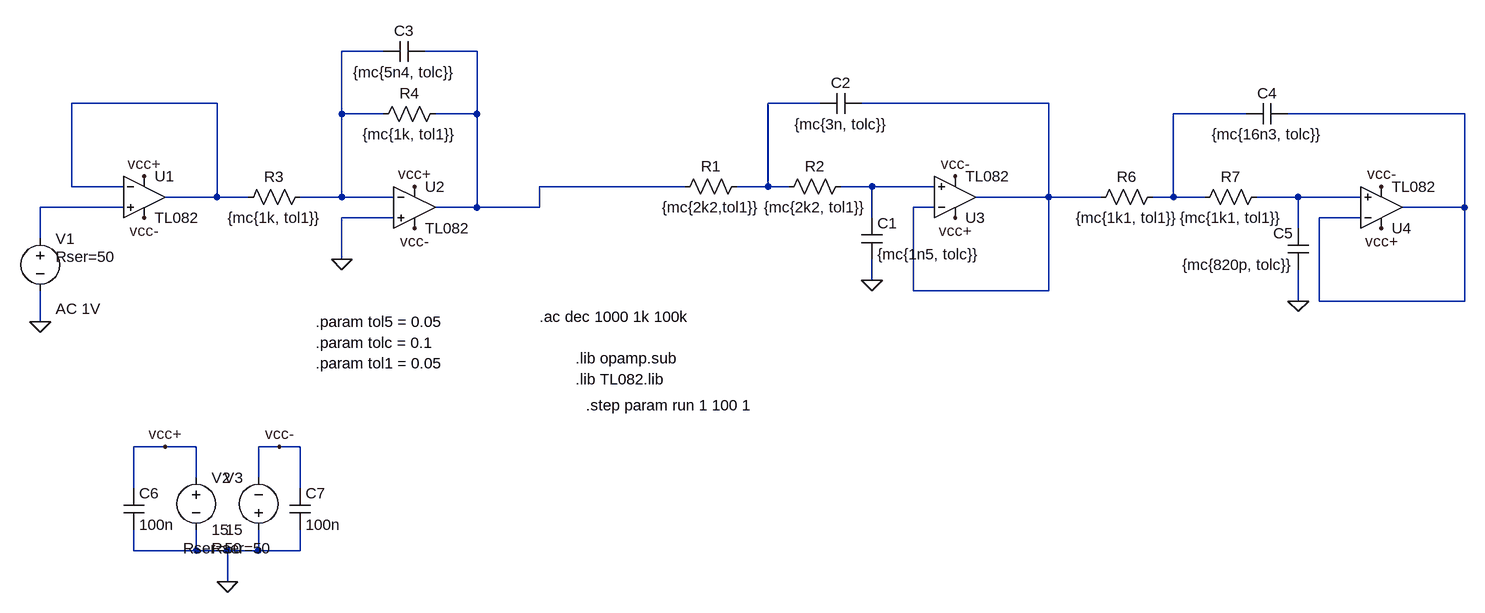
[diagram p0: schematic tc_tp5_ej1_leg.asc]
tc_tp5_ej1_leg.asc, the LTspice schematic file:
Version 4
SHEET 1 1312 724
WIRE -384 -112 -448 -112
WIRE -240 -112 -320 -112
WIRE -640 -32 -864 -32
WIRE 288 -32 208 -32
WIRE 640 -32 352 -32
WIRE -448 -16 -448 -112
WIRE -384 -16 -448 -16
WIRE -240 -16 -240 -112
WIRE -240 -16 -304 -16
WIRE 944 -16 832 -16
WIRE 1280 -16 1008 -16
WIRE -864 96 -864 -32
WIRE -784 96 -864 96
WIRE 80 96 -144 96
WIRE 208 96 208 -32
WIRE 208 96 160 96
WIRE 240 96 208 96
WIRE 368 96 320 96
WIRE 464 96 368 96
WIRE -640 112 -640 -32
WIRE -640 112 -720 112
WIRE -592 112 -640 112
WIRE -448 112 -448 -16
WIRE -448 112 -512 112
WIRE -368 112 -448 112
WIRE 640 112 640 -32
WIRE 640 112 528 112
WIRE 720 112 640 112
WIRE 832 112 832 -16
WIRE 832 112 800 112
WIRE 880 112 832 112
WIRE 1024 112 960 112
WIRE 1120 112 1024 112
WIRE -784 128 -912 128
WIRE -240 128 -240 -16
WIRE -240 128 -304 128
WIRE -144 128 -144 96
WIRE -144 128 -240 128
WIRE 464 128 432 128
WIRE 1280 128 1280 -16
WIRE 1280 128 1184 128
WIRE -368 144 -448 144
WIRE 368 144 368 96
WIRE 1120 144 1056 144
WIRE 1024 160 1024 112
WIRE -912 176 -912 128
WIRE -448 208 -448 144
WIRE 368 240 368 208
WIRE 432 256 432 128
WIRE 640 256 640 112
WIRE 640 256 432 256
WIRE 1024 272 1024 224
WIRE 1056 272 1056 144
WIRE 1280 272 1280 128
WIRE 1280 272 1056 272
WIRE -912 304 -912 256
WIRE -720 496 -768 496
WIRE -672 496 -720 496
WIRE -544 496 -576 496
WIRE -512 496 -544 496
WIRE -672 544 -672 496
WIRE -576 544 -576 496
WIRE -768 560 -768 496
WIRE -512 560 -512 496
WIRE -768 656 -768 624
WIRE -672 656 -672 624
WIRE -672 656 -768 656
WIRE -624 656 -672 656
WIRE -576 656 -576 624
WIRE -576 656 -624 656
WIRE -512 656 -512 624
WIRE -512 656 -576 656
WIRE -624 704 -624 656
FLAG -912 304 0
FLAG 368 240 0
FLAG -448 208 0
FLAG 1024 272 0
FLAG -624 704 0
FLAG -720 496 vcc+
FLAG -752 80 vcc+
FLAG -336 96 vcc+
FLAG 496 144 vcc+
FLAG -544 496 vcc-
FLAG 496 80 vcc-
FLAG -336 160 vcc-
FLAG -752 144 vcc-
FLAG 1152 160 vcc+
FLAG 1152 96 vcc-
SYMBOL res 176 80 R90
WINDOW 0 0 56 VBottom 2
WINDOW 3 32 56 VTop 2
SYMATTR InstName R1
SYMATTR Value {mc{2k2,tol1}}
SYMBOL res 336 80 R90
WINDOW 0 0 56 VBottom 2
WINDOW 3 32 56 VTop 2
SYMATTR InstName R2
SYMATTR Value {mc{2k2, tol1}}
SYMBOL cap 352 144 R0
SYMATTR InstName C1
SYMATTR Value {mc{1n5, tolc}}
SYMBOL cap 352 -48 R90
WINDOW 0 0 32 VBottom 2
WINDOW 3 32 32 VTop 2
SYMATTR InstName C2
SYMATTR Value {mc{3n, tolc}}
SYMBOL voltage -912 160 R0
WINDOW 123 24 124 Left 2
WINDOW 39 24 44 Left 2
SYMATTR Value2 AC 1V
SYMATTR SpiceLine Rser=50
SYMATTR InstName V1
SYMATTR Value ""
SYMBOL res -496 96 R90
WINDOW 0 0 56 VBottom 2
WINDOW 3 32 56 VTop 2
SYMATTR InstName R3
SYMATTR Value {mc{1k, tol1}}
SYMBOL res -288 -32 R90
WINDOW 0 0 56 VBottom 2
WINDOW 3 32 56 VTop 2
SYMATTR InstName R4
SYMATTR Value {mc{1k, tol1}}
SYMBOL cap -320 -128 R90
WINDOW 0 0 32 VBottom 2
WINDOW 3 32 32 VTop 2
SYMATTR InstName C3
SYMATTR Value {mc{5n4, tolc}}
SYMBOL res 816 96 R90
WINDOW 0 0 56 VBottom 2
WINDOW 3 32 56 VTop 2
SYMATTR InstName R6
SYMATTR Value {mc{1k1, tol1}}
SYMBOL res 976 96 R90
WINDOW 0 0 56 VBottom 2
WINDOW 3 32 56 VTop 2
SYMATTR InstName R7
SYMATTR Value {mc{1k1, tol1}}
SYMBOL cap 1008 -32 R90
WINDOW 0 0 32 VBottom 2
WINDOW 3 32 32 VTop 2
SYMATTR InstName C4
SYMATTR Value {mc{16n3, tolc}}
SYMBOL cap 1040 224 R180
WINDOW 0 24 56 Left 2
WINDOW 3 24 8 Left 2
SYMATTR InstName C5
SYMATTR Value {mc{820p, tolc}}
SYMBOL Opamps\\opamp2 -752 48 R0
SYMATTR InstName U1
SYMATTR Value TL082
SYMBOL Opamps\\opamp2 -336 64 R0
SYMATTR InstName U2
SYMATTR Value TL082
SYMBOL Opamps\\opamp2 496 176 M180
SYMATTR InstName U3
SYMATTR Value TL082
SYMBOL Opamps\\opamp2 1152 192 M180
SYMATTR InstName U4
SYMATTR Value TL082
SYMBOL cap -784 560 R0
SYMATTR InstName C6
SYMATTR Value 100n
SYMBOL cap -528 560 R0
SYMATTR InstName C7
SYMATTR Value 100n
SYMBOL voltage -672 528 R0
WINDOW 123 0 0 Left 0
WINDOW 39 24 124 Left 2
SYMATTR SpiceLine Rser=50
SYMATTR InstName V2
SYMATTR Value 15
SYMBOL voltage -576 640 R180
WINDOW 0 24 96 Left 2
WINDOW 3 24 16 Left 2
WINDOW 123 0 0 Left 0
WINDOW 39 24 -12 Left 2
SYMATTR InstName V3
SYMATTR Value 15
SYMATTR SpiceLine Rser=50
TEXT -144 296 Left 2 !.ac dec 1000 1k 100k
TEXT -88 360 Left 2 !.lib opamp.sub
TEXT -488 304 Left 2 !.param tol5 = 0.05
TEXT -488 336 Left 2 !.param tolc = 0.1
TEXT -488 368 Left 2 !.param tol1 = 0.05
TEXT -88 392 Left 2 !.lib TL082.lib
TEXT -72 432 Left 2 !.step param run 1 100 1

The netlist it stands for:
* tc_tp5_ej1_leg.asc
R1 N004 N002 {mc{2k2,tol1}}
R2 N008 N004 {mc{2k2, tol1}}
C1 N008 0 {mc{1n5, tolc}}
C2 N005 N004 {mc{3n, tolc}}
V1 N010 0 AC 1V Rser=50
R3 N001 N003 {mc{1k, tol1}}
R4 N002 N001 {mc{1k, tol1}}
C3 N002 N001 {mc{5n4, tolc}}
R6 N006 N005 {mc{1k1, tol1}}
R7 N009 N006 {mc{1k1, tol1}}
C4 N007 N006 {mc{16n3, tolc}}
C5 0 N009 {mc{820p, tolc}}
XU1 N010 N003 vcc+ vcc- N003 TL082  ; pins In+ In- V+ V- OUT
XU2 0 N001 vcc+ vcc- N002 TL082  ; pins In+ In- V+ V- OUT
XU3 N008 N005 vcc+ vcc- N005 TL082  ; pins In+ In- V+ V- OUT
XU4 N009 N007 vcc+ vcc- N007 TL082  ; pins In+ In- V+ V- OUT
C6 vcc+ 0 100n
C7 vcc- 0 100n
V2 vcc+ 0 15 Rser=50
V3 0 vcc- 15 Rser=50
.ac dec 1000 1k 100k
.lib opamp.sub
.param tol5 = 0.05
.param tolc = 0.1
.param tol1 = 0.05
.lib TL082.lib
.step param run 1 100 1
.backanno
.end